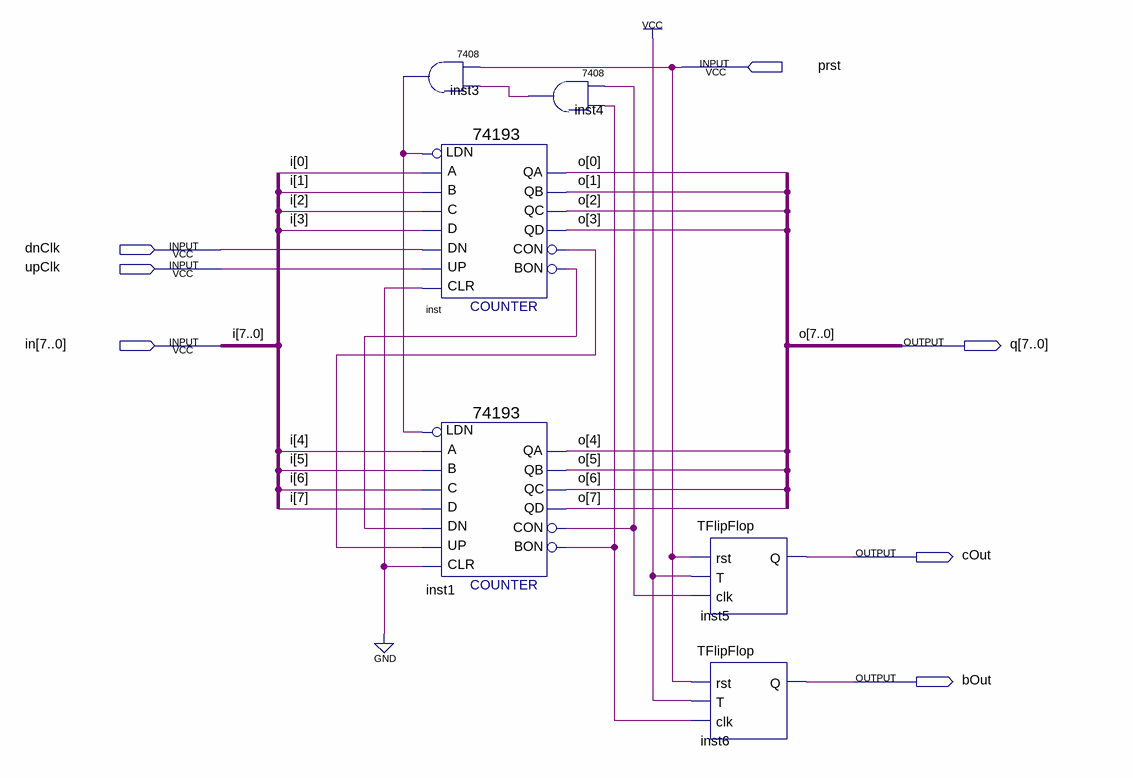
[diagram p0: schematic sheet]
// Quartus schematic FrequencyDivider.bdf as structural Verilog: 6 symbols, 7 pins
module FrequencyDivider (
  input  prst,
  input  dnClk,
  input  upClk,
  input  [7:0] in,
  output [7:0] q,
  output cOut,
  output bOut
);

  wire inst1_bon, inst1_con, inst3_1, inst4_1, inst_bon, inst_con;

  \7408  inst3 (.\3 (inst4_1), .\2 (prst), .\1 (inst3_1));
  \74193  inst (
    .D(in[3]), .C(in[2]), .B(in[1]), .A(in[0]), .CLR(1'b0), .UP(upClk), .DN(dnClk), .LDN(inst3_1), .QB(q[1]),
    .QA(q[0]), .CON(inst_con), .QD(q[3]), .QC(q[2]), .BON(inst_bon));
  \74193  inst1 (
    .D(in[7]), .C(in[6]), .B(in[5]), .A(in[4]), .CLR(1'b0), .UP(inst_con), .DN(inst_bon), .LDN(inst3_1),
    .QB(q[5]), .QA(q[4]), .CON(inst1_con), .QD(q[7]), .QC(q[6]), .BON(inst1_bon));
  \7408  inst4 (.\3 (inst1_bon), .\2 (inst1_con), .\1 (inst4_1));
  TFlipFlop inst5 (.rst(prst), .T(1'b1), .clk(inst1_con), .Q(cOut));
  TFlipFlop inst6 (.rst(prst), .T(1'b1), .clk(inst1_bon), .Q(bOut));

  // Other names for the same wires on the sheet: i[7:0] = in; o[7:0] = q
endmodule
